# EAGLE schematic SparkInterfaceBreadboardSupplement_v1 (EAGLE 9.7.0)
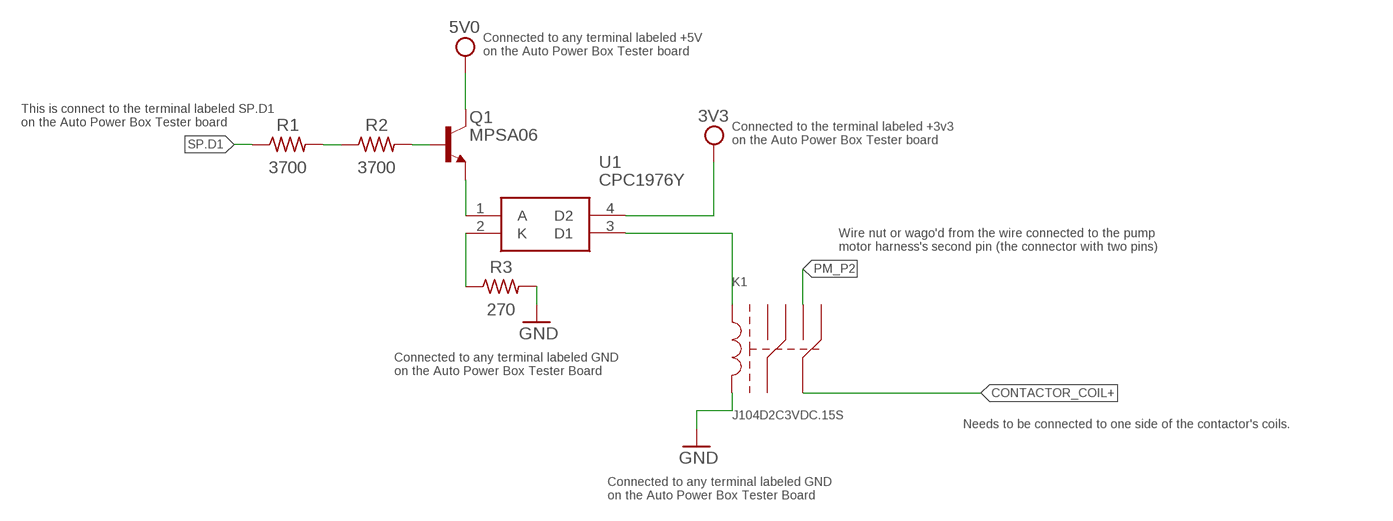
[diagram p0: schematic, sheet 1]

## Parts
K1  J104D2C3VDC.15S  [J104D2C3VDC.15S]
Q1  MPSA06  NPN_BC549_TO92-CBE  [TO92]
R1  3700  R-US_AXIAL-7.2MM-PITCH  [RESAD724W46L381D178B]
R2  3700  R-US_AXIAL-7.2MM-PITCH  [RESAD724W46L381D178B]
R3  270  R-US_AXIAL-7.2MM-PITCH  [RESAD724W46L381D178B]
U1  CPC1976Y  AQY212GHAX  [SOP254P962X315-4N]

## Nets
3V3: U1.4(D2)
5V0: Q1.1(C)
CONTACTOR_COIL+: K1.4(C2)
GND: K1.1(LA) R3.2
N$1: Q1.3(E) U1.1(A)
N$2: R3.1 U1.2(K)
N$3: K1.2(LB) U1.3(D1)
N$4: R1.2 R2.1
N$5: Q1.2(B) R2.2
PM_P2: K1.8(NO2)
SP.D1: R1.1
Unconnected: K1.3(C1) K1.5(NC1) K1.6(NC2) K1.7(NO1)

## Notes on the sheet
- Connected to any terminal labeled +5V 
  on the Auto Power Box Tester board
- This is connect to the terminal labeled SP.D1 
  on the Auto Power Box Tester board
- Connected to the terminal labeled +3v3 
  on the Auto Power Box Tester board
- Wire nut or wago'd from the wire connected to the pump 
  motor harness's second pin (the connector with two pins)
- Connected to any terminal labeled GND 
  on the Auto Power Box Tester Board
- Needs to be connected to one side of the contactor's coils.
- Connected to any terminal labeled GND 
  on the Auto Power Box Tester Board

## Library data of the parts
K1 = ADVANCEDPBTLIB:J104D2C3VDC.15S
Q1 = Transistor:NPN_: NPN - Popular parts; CATEGORY: Transistor; MANUFACTURER: Onsemi; MPN: BC549; SUB-CATEGORY: BJT; TYPE: NPN; VALUE: BC549
R1-R3 = Resistor:R-US: Resistor Fixed - ANSI; CATEGORY: Resistor; SUB-CATEGORY: Fixed
U1 = ADVANCEDPBTLIB:AQY212GHAX: PANASONIC - AQY212GHAX - MOSFET Relay, SPST-NO, 1.1 A, Gull Wing, 60 V, 0.7 ohm, 5 kV Source: Datasheet <https://www.digikey.in/product-detail/en/panasonic-electric-works/AQY212GHAX/255-6063-1-ND/8549338>; ARROW_PART_NUMBER: AQY212GHAX; ARROW_PRICE-STOCK: https://www.arrow.com/en/products/aqy212ghax/panasonic?region=europe; DESCRIPTION: PANASONIC - AQY212GHAX - MOSFET Relay, SPST-NO, 1.1 A, Gull Wing, 60 V, 0.7 ohm, 5 kV; HEIGHT: 3.15mm; MANUFACTURER_NAME: Panasonic; MANUFACTURER_PART_NUMBER: AQY212GHAX; MOUSER_PART_NUMBER: 667-AQY212GHAX; MOUSER_PRICE-STOCK: https://www.mouser.co.uk/ProductDetail/Panasonic-Industrial-Devices/AQY212GHAX?qs=wKtUvITRiamLwz7hthc4Hg%3D%3D